# EAGLE schematic Heart Rate Monitoring System (EAGLE 6.3)
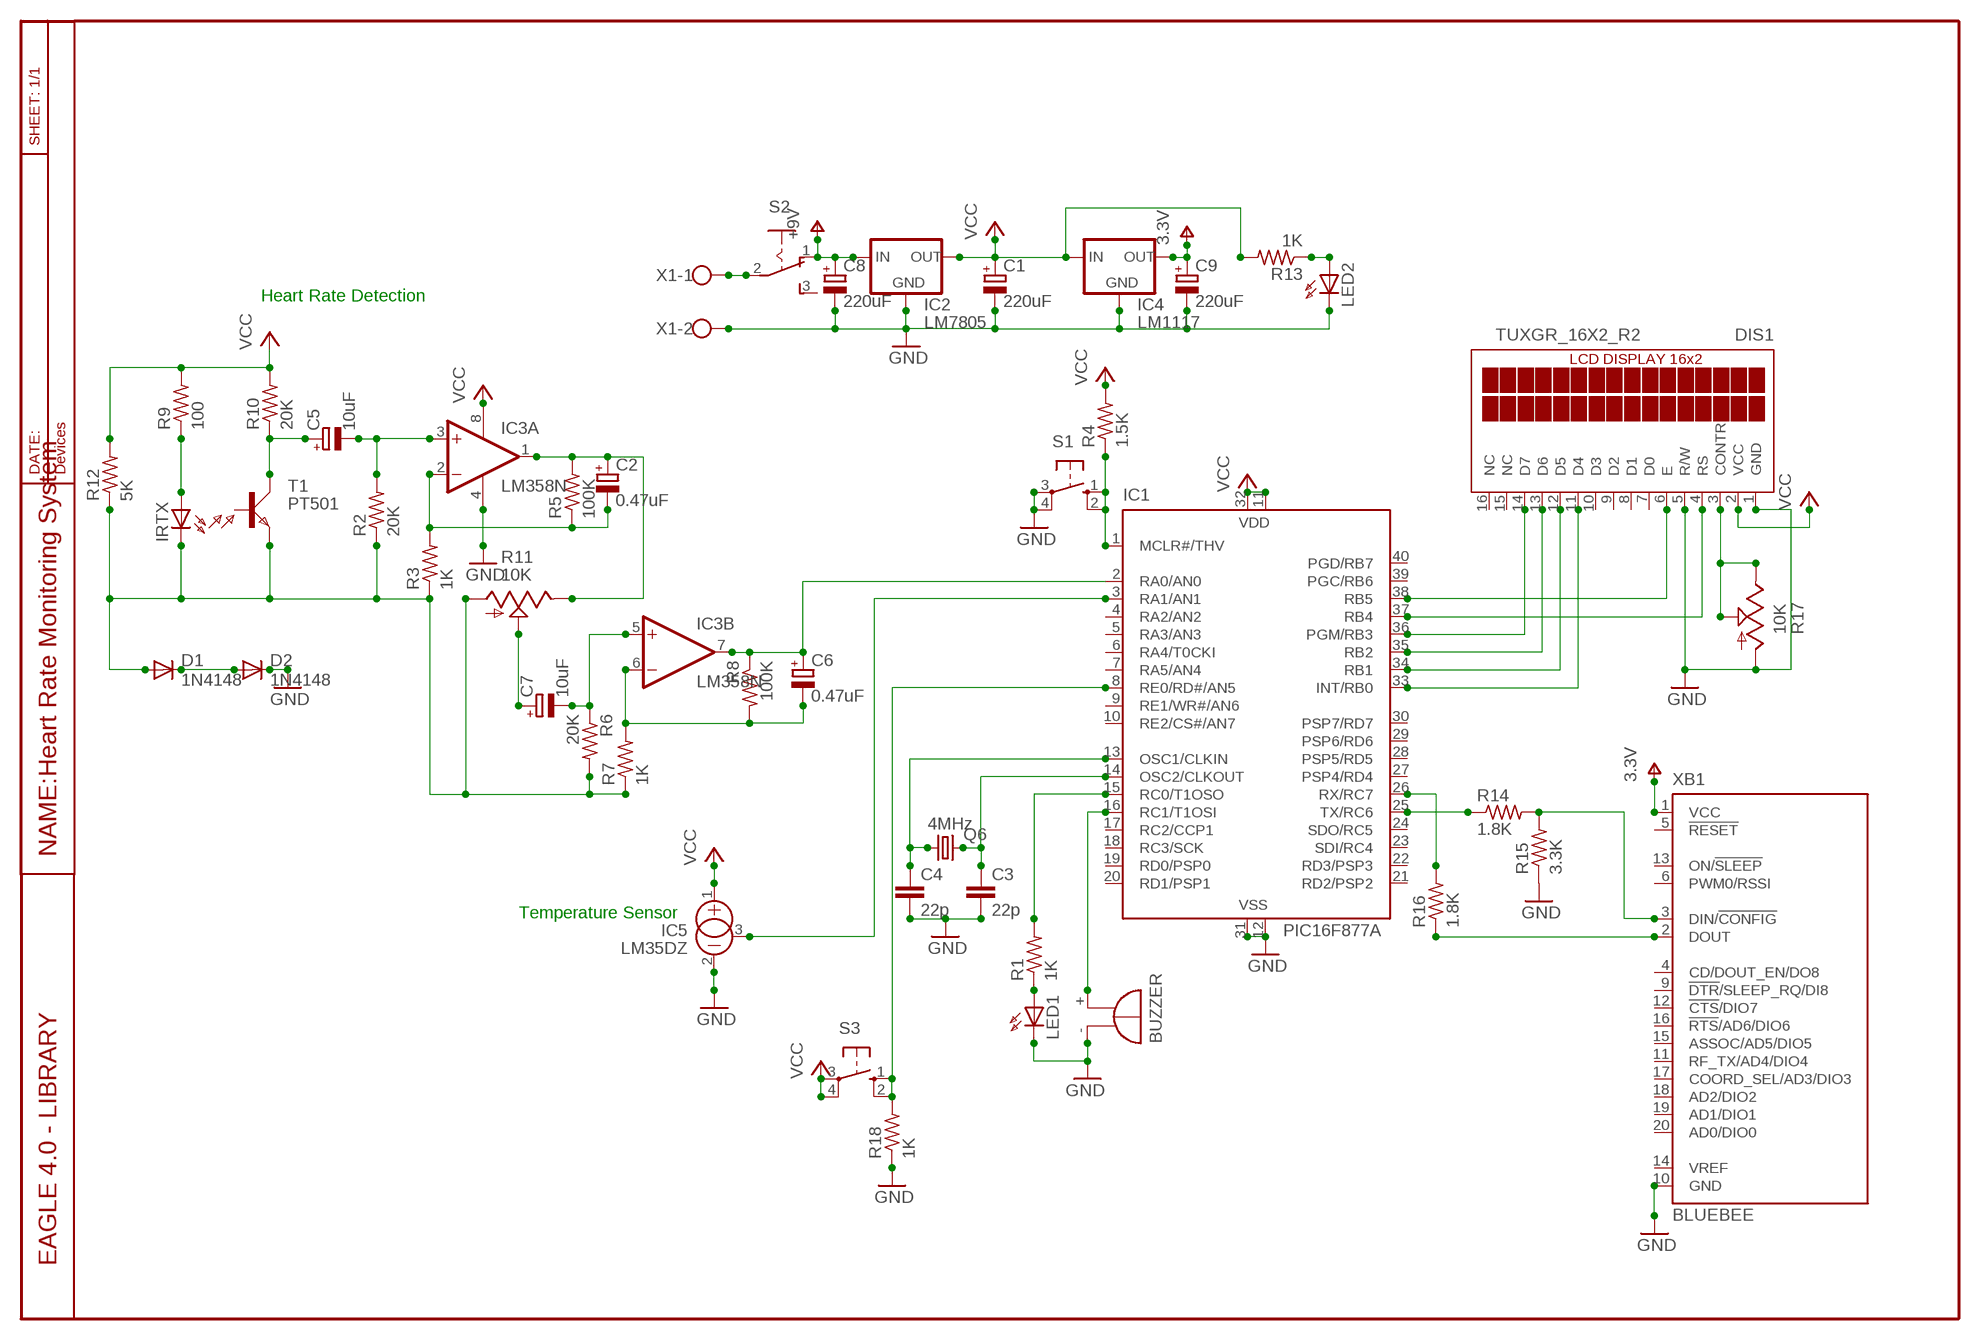
[diagram p0: schematic, sheet 1]

## Parts
BUZZER  F/QMBIII  [F/QMBIII]
C1  220uF  CPOL-EUE3.5-10  [E3,5-10]
C2  0.47uF  CPOL-EUE2-5  [E2-5]
C3  22p  C-EU025-025X050  [C025-025X050]
C4  22p  C-EU025-025X050  [C025-025X050]
C5  10uF  CPOL-EUE2-5  [E2-5]
C6  0.47uF  CPOL-EUE2-5  [E2-5]
C7  10uF  CPOL-EUE2-5  [E2-5]
C8  220uF  CPOL-EUE3.5-10  [E3,5-10]
C9  220uF  CPOL-EUE3.5-10  [E3,5-10]
D1  1N4148  1N4148DO35-7  [DO35-7]
D2  1N4148  1N4148DO35-7  [DO35-7]
DIS1  TUXGR_16X2_R2  [TUXGR_16X2_R2]
IC1  PIC16F877A  PIC16F877P  [DIL40]
IC2  LM7805  78MXXS  [78MXXS]
IC3  LM358N  [DIL08]
IC4  LM1117  78MXXS  [78MXXS]
IC5  LM35DZ  AD590ZR  [TO92]
IRTX  LED5MM  [LED5MM]
LED1  LED3MM  [LED3MM]
LED2  LED3MM  [LED3MM]
Q6  4MHz  CRYTALHC18U-V  [HC18U-V]
R1  1K  R-US_0207/7  [0207/7]
R2  20K  R-US_0207/7  [0207/7]
R3  1K  R-US_0207/7  [0207/7]
R4  1.5K  R-US_0204/7  [0204/7]
R5  100K  R-US_0207/7  [0207/7]
R6  20K  R-US_0207/7  [0207/7]
R7  1K  R-US_0207/7  [0207/7]
R8  100K  R-US_0207/7  [0207/7]
R9  100  R-US_0207/7  [0207/7]
R10  20K  R-US_0207/7  [0207/7]
R11  10K  TRIM_US-CA6V  [CA6V]
R12  5K  R-US_0207/7  [0207/7]
R13  1K  R-US_0207/7  [0207/7]
R14  1.8K  R-US_0207/7  [0207/7]
R15  3.3K  R-US_0207/7  [0207/7]
R16  1.8K  R-US_0207/7  [0207/7]
R17  10K  TRIM_US-CA6V  [CA6V]
R18  1K  R-US_0207/7  [0207/7]
S1  10-XX  [B3F-10XX]
S2  255SB  [255SB]
S3  10-XX  [B3F-10XX]
T1  PT501  BP103  [BP103]
X1  AK500/2  [AK500/2]
XB1  BLUEBEE  XBEE  [XBEE]

## Nets
GND: BUZZER.-(+) C1.- C3.2 C4.2 C8.- C9.- D2.C DIS1.1(GND) DIS1.5(R/W) IC1.12(VSS) IC1.31(VSS) IC2.GND IC3.4(P:V-) IC4.GND IC5.2(-) LED1.K(C) LED2.K(C) R15.1 R17.A R18.1 S1.3(P) S1.4(P1) X1.2 XB1.10(GND)
N$1: C2.+ IC3.1(A:OUT) R5.2 R11.E
N$2: C5.- IC3.3(A:+IN) R2.2
N$3: S2.2(P) X1.1
N$4: LED2.A R13.1
N$5: IC1.1(MCLR#/THV) R4.1 S1.1(S) S1.2(S1)
N$6: C3.1 IC1.14(OSC2/CLKOUT) Q6.2
N$7: LED1.A R1.1
N$8: IC1.15(RC0/T1OSO) R1.2
N$9: BUZZER.+(-) IC1.16(RC1/T1OSI)
N$10: C2.- IC3.2(A:-IN) R3.2 R5.1
N$11: C7.+ R11.S
N$12: C7.- IC3.5(B:+IN) R6.1
N$13: C6.+ IC1.2(RA0/AN0) IC3.7(B:OUT) R8.1
N$14: C6.- IC3.6(B:-IN) R7.2 R8.2
N$15: C5.+ R10.1 T1.C
N$16: C4.1 IC1.13(OSC1/CLKIN) Q6.1
N$17: IRTX.A R9.1
N$18: D1.C D2.A
N$19: D1.A IRTX.K(C) R2.1 R3.1 R6.2 R7.1 R11.A R12.1 T1.E
N$20: DIS1.11(D4) IC1.33(INT/RB0)
N$21: DIS1.12(D5) IC1.34(RB1)
N$22: R16.1 XB1.2(DOUT)
N$23: IC1.25(TX/RC6) R14.1
N$24: R14.2 R15.2 XB1.3(DIN/!CONFIG)
N$25: IC1.26(RX/RC7) R16.2
N$26: DIS1.13(D6) IC1.35(RB2)
N$27: DIS1.6(E) IC1.38(RB5)
N$28: DIS1.3(CONTR) R17.E R17.S
N$29: DIS1.14(D7) IC1.36(PGM/RB3)
N$30: DIS1.4(RS) IC1.37(RB4)
N$32: IC1.3(RA1/AN1) IC5.3(CAN)
N$33: IC1.8(RE0/RD#/AN5) R18.2 S3.1(S) S3.2(S1)
V+: C8.+ C9.+ IC2.IN IC4.OUT S2.1(O) XB1.1(VCC) ; supply symbol labelled +9V, 3.3V
VCC: C1.+ DIS1.2(VCC) IC1.11(VDD) IC1.32(VDD) IC2.OUT IC3.8(P:V+) IC4.IN IC5.1(+) R4.2 R9.2 R10.2 R12.2 R13.2 S3.3(P) S3.4(P1)
Unconnected: DIS1.7(D0) DIS1.8(D1) DIS1.9(D2) DIS1.10(D3) DIS1.15(NC) DIS1.16(NC) IC1.4(RA2/AN2) IC1.5(RA3/AN3) IC1.6(RA4/T0CKI) IC1.7(RA5/AN4) IC1.9(RE1/WR#/AN6) IC1.10(RE2/CS#/AN7) IC1.17(RC2/CCP1) IC1.18(RC3/SCK) IC1.19(RD0/PSP0) IC1.20(RD1/PSP1) IC1.21(RD2/PSP2) IC1.22(RD3/PSP3) IC1.23(SDI/RC4) IC1.24(SDO/RC5) IC1.27(PSP4/RD4) IC1.28(PSP5/RD5) IC1.29(PSP6/RD6) IC1.30(PSP7/RD7) IC1.39(PGC/RB6) IC1.40(PGD/RB7) S2.3(S) T1.B XB1.4(CD/DOUT_EN/DO8) XB1.5(!RESET) XB1.6(PWM0/RSSI) XB1.9(!DTR!/SLEEP_RQ/DI8) XB1.11(RF_TX/AD4/DIO4) XB1.12(!CTS!/DIO7) XB1.13(ON/!SLEEP) XB1.14(VREF) XB1.15(ASSOC/AD5/DIO5) XB1.16(!RTS!/AD6/DIO6) XB1.17(COORD_SEL/AD3/DIO3) XB1.18(AD2/DIO2) XB1.19(AD1/DIO1) XB1.20(AD0/DIO0)

## Notes on the sheet
- Heart Rate Detection
- Temperature Sensor

## Library data of the parts
BUZZER = buzzer:F/QMBIII: BUZZER Source: Buerklin
C1 C2 C5-C9 = rcl:CPOL-EU: POLARIZED CAPACITOR, European symbol
C3 C4 = rcl:C-EU: CAPACITOR, European symbol
D1 D2 = diode:1N4148: DIODE high speed (Philips)
DIS1 = display-lcd:TUXGR_16X2_R2: Tuxgraphics LCD display 16x2 characters reflective, without background light Source: tuxgr_12x2_r2.pdf; OC_FARNELL: unknown; OC_NEWARK: unknown
IC1 = microchip:PIC16F87*: MICROCONTROLLER
IC2 IC4 = v-reg:78MXXS: VOLTAGE REGULATOR
IC3 = linear:LM358: OP AMP
IC5 = linear:AD590ZR: TEMPERATURE SENSOR current output
IRTX LED1 LED2 = led:LED: LED
Q6 = crystal:CRYTAL: CRYSTAL
R1-R10 R12-R16 R18 = rcl:R-US_: RESISTOR, American symbol
R11 R17 = pot:TRIM_US-: POTENTIOMETER
S1 S3 = switch-omron:10-XX: OMRON SWITCH
S2 = switch:255SB: SLIDING SWITCH distributor Buerklin, 11G810
T1 = opto-trans-siemens:BP103: PHOTO TRANSISTOR
X1 = con-ptr500:AK500/2: CONNECTOR
XB1 = maxstream:XBEE: XBee (TM) /XBee-PRO(TM) OEM RF Modules Source: MaxStream, Inc. xbee_productmanual.pdf; MPN: XBP24-Z7UIT-004; OC_FARNELL: 1751799; OC_NEWARK: 34R5507